# EAGLE design DimBlue (EAGLE 5.11)
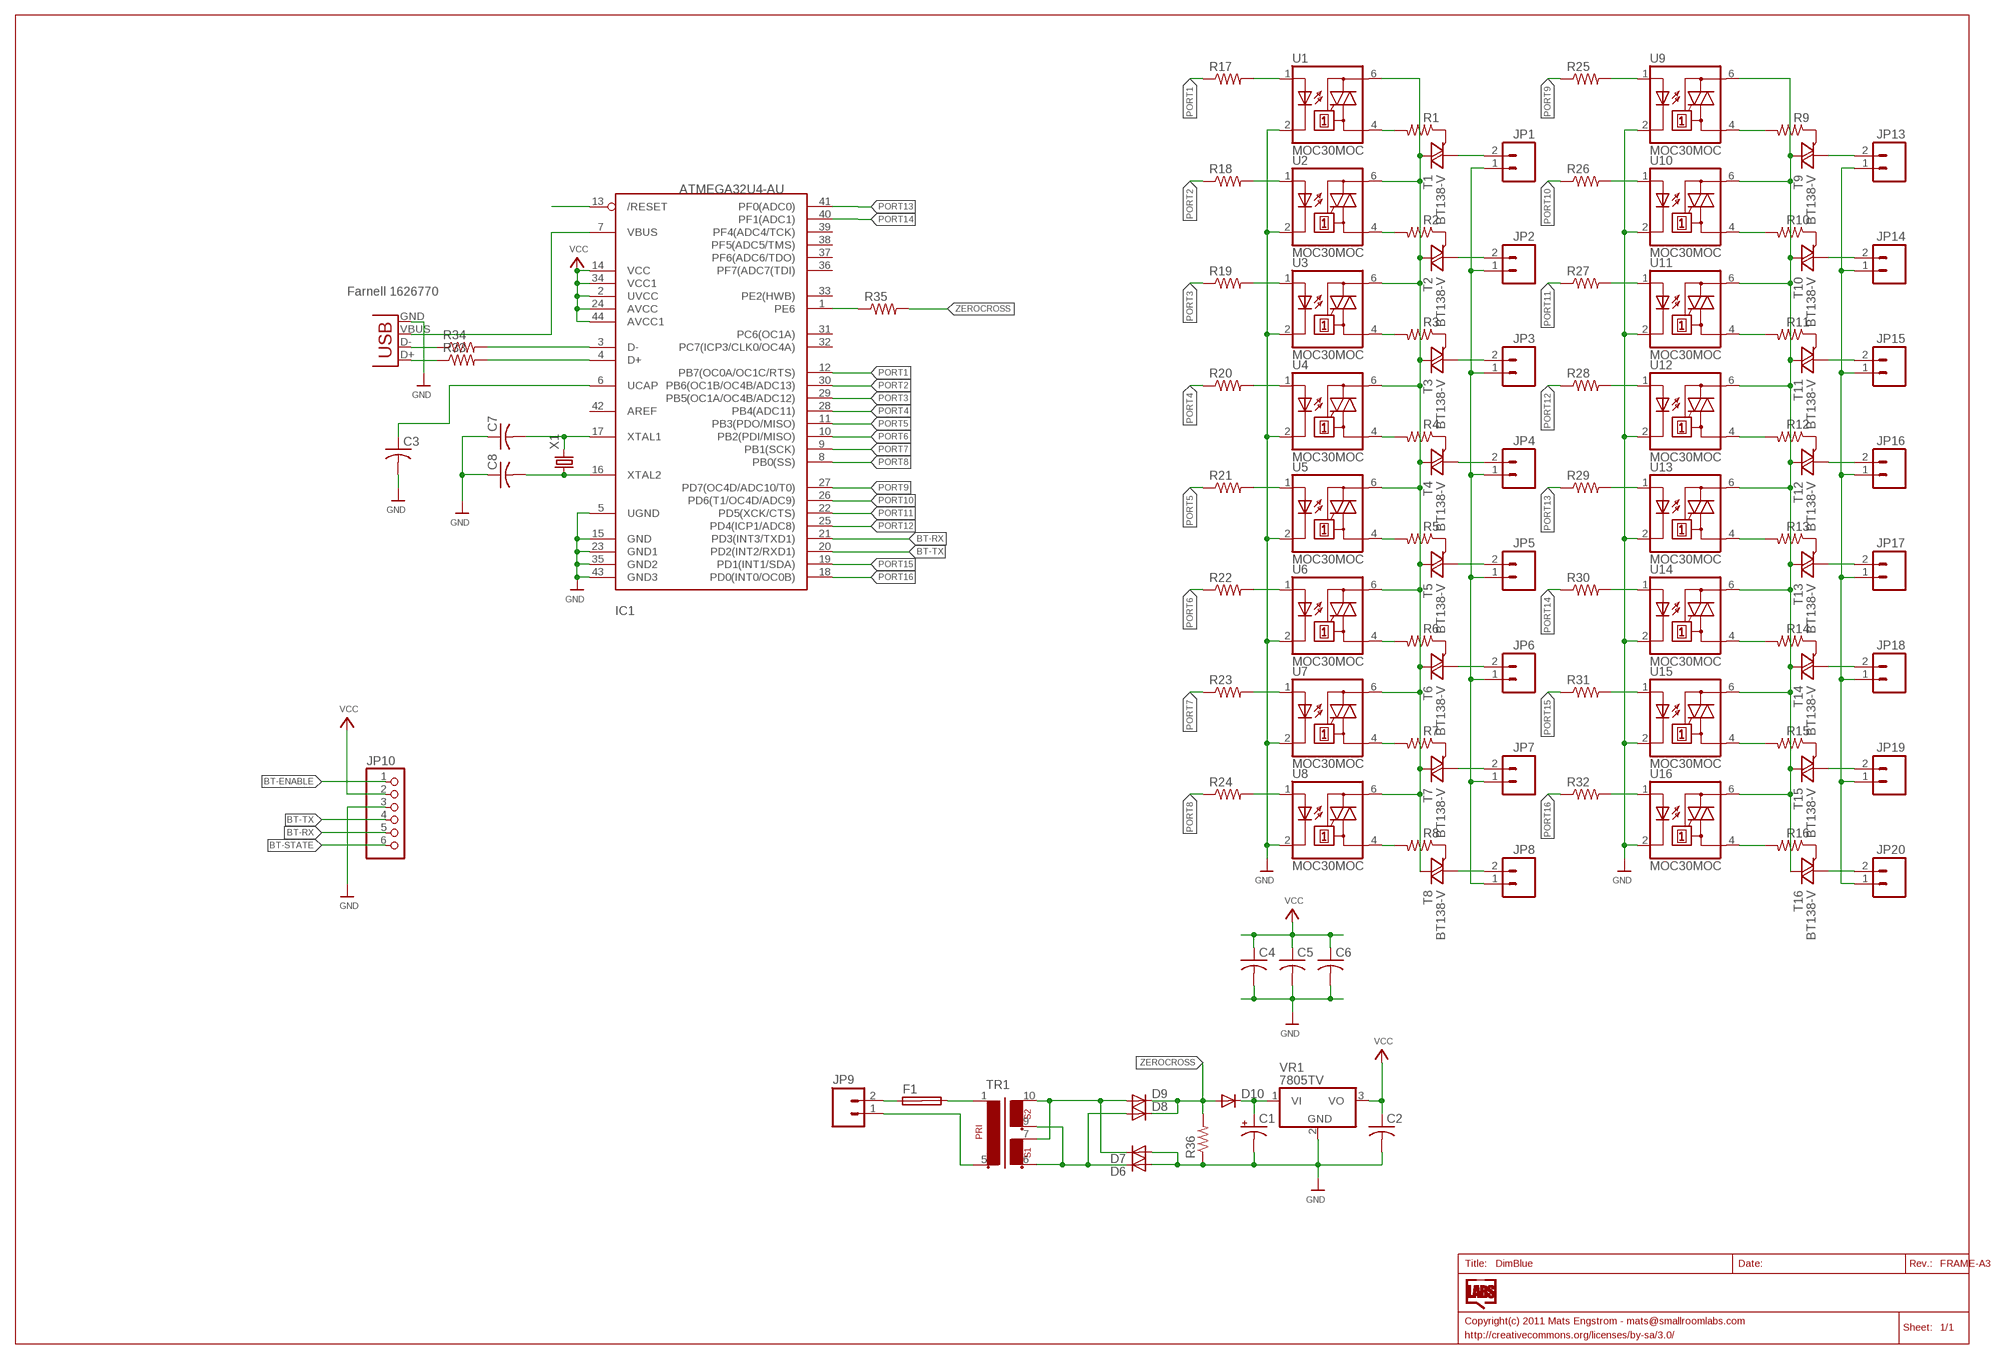
[diagram p0: schematic, sheet 1]

## Parts
C1  CAP_POLPTH4  [CPOL-RADIAL-1000UF-25V]
C2  C-US025-025X050  [C025-025X050]
C3  C-US025-025X050  [C025-025X050]
C4  C-US025-025X050  [C025-025X050]
C5  C-US025-025X050  [C025-025X050]
C6  C-US025-025X050  [C025-025X050]
C7  C-US025-024X044  [C025-024X044]
C8  C-US025-024X044  [C025-024X044]
D6  DIODE-C1702-05  [C1702-05]
D7  DIODE-C1702-05  [C1702-05]
D8  DIODE-C1702-05  [C1702-05]
D9  DIODE-C1702-05  [C1702-05]
D10  DIODE-C1702-05  [C1702-05]
F1  SHK20L  [SHK20L]
IC1  ATMEGA32U4-AU  [TQFP44]
JP1  M023.5MM  [SCREWTERMINAL-3.5MM-2]
JP2  M023.5MM  [SCREWTERMINAL-3.5MM-2]
JP3  M023.5MM  [SCREWTERMINAL-3.5MM-2]
JP4  M023.5MM  [SCREWTERMINAL-3.5MM-2]
JP5  M023.5MM  [SCREWTERMINAL-3.5MM-2]
JP6  M023.5MM  [SCREWTERMINAL-3.5MM-2]
JP7  M023.5MM  [SCREWTERMINAL-3.5MM-2]
JP8  M023.5MM  [SCREWTERMINAL-3.5MM-2]
JP9  M023.5MM  [SCREWTERMINAL-3.5MM-2]
JP10  HEADER-1X6  [1X06_OVAL]
JP13  M023.5MM  [SCREWTERMINAL-3.5MM-2]
JP14  M023.5MM  [SCREWTERMINAL-3.5MM-2]
JP15  M023.5MM  [SCREWTERMINAL-3.5MM-2]
JP16  M023.5MM  [SCREWTERMINAL-3.5MM-2]
JP17  M023.5MM  [SCREWTERMINAL-3.5MM-2]
JP18  M023.5MM  [SCREWTERMINAL-3.5MM-2]
JP19  M023.5MM  [SCREWTERMINAL-3.5MM-2]
JP20  M023.5MM  [SCREWTERMINAL-3.5MM-2]
R1  R-US_0204/7  [0204/7]
R2  R-US_0204/7  [0204/7]
R3  R-US_0204/7  [0204/7]
R4  R-US_0204/7  [0204/7]
R5  R-US_0204/7  [0204/7]
R6  R-US_0204/7  [0204/7]
R7  R-US_0204/7  [0204/7]
R8  R-US_0204/7  [0204/7]
R9  R-US_0204/7  [0204/7]
R10  R-US_0204/7  [0204/7]
R11  R-US_0204/7  [0204/7]
R12  R-US_0204/7  [0204/7]
R13  R-US_0204/7  [0204/7]
R14  R-US_0204/7  [0204/7]
R15  R-US_0204/7  [0204/7]
R16  R-US_0204/7  [0204/7]
R17  R-US_0204/2V  [0204V]
R18  R-US_0204/2V  [0204V]
R19  R-US_0204/2V  [0204V]
R20  R-US_0204/2V  [0204V]
R21  R-US_0204/2V  [0204V]
R22  R-US_0204/2V  [0204V]
R23  R-US_0204/2V  [0204V]
R24  R-US_0204/2V  [0204V]
R25  R-US_0204/2V  [0204V]
R26  R-US_0204/2V  [0204V]
R27  R-US_0204/2V  [0204V]
R28  R-US_0204/2V  [0204V]
R29  R-US_0204/2V  [0204V]
R30  R-US_0204/2V  [0204V]
R31  R-US_0204/2V  [0204V]
R32  R-US_0204/2V  [0204V]
R33  R-US_0204/2V  [0204V]
R34  R-US_0204/2V  [0204V]
R35  R-US_0204/2V  [0204V]
R36  R-US_0204/2V  [0204V]
T1  BT138-V  [TO220BV]
T2  BT138-V  [TO220BV]
T3  BT138-V  [TO220BV]
T4  BT138-V  [TO220BV]
T5  BT138-V  [TO220BV]
T6  BT138-V  [TO220BV]
T7  BT138-V  [TO220BV]
T8  BT138-V  [TO220BV]
T9  BT138-V  [TO220BV]
T10  BT138-V  [TO220BV]
T11  BT138-V  [TO220BV]
T12  BT138-V  [TO220BV]
T13  BT138-V  [TO220BV]
T14  BT138-V  [TO220BV]
T15  BT138-V  [TO220BV]
T16  BT138-V  [TO220BV]
TR1  EI30-2  [EI30-2]
U1  MOC30MOC  [DIL06-MOC]
U2  MOC30MOC  [DIL06-MOC]
U3  MOC30MOC  [DIL06-MOC]
U4  MOC30MOC  [DIL06-MOC]
U5  MOC30MOC  [DIL06-MOC]
U6  MOC30MOC  [DIL06-MOC]
U7  MOC30MOC  [DIL06-MOC]
U8  MOC30MOC  [DIL06-MOC]
U9  MOC30MOC  [DIL06-MOC]
U10  MOC30MOC  [DIL06-MOC]
U11  MOC30MOC  [DIL06-MOC]
U12  MOC30MOC  [DIL06-MOC]
U13  MOC30MOC  [DIL06-MOC]
U14  MOC30MOC  [DIL06-MOC]
U15  MOC30MOC  [DIL06-MOC]
U16  MOC30MOC  [DIL06-MOC]
USB  USBPTH  [USB-B-PTH]
VR1  7805TV  [TO220V]
X1  CRYSTALHC49US  [HC49US]

## Nets
BT-ENABLE: JP10.1
BT-RX: IC1.21(PD3(INT3/TXD1)) JP10.5
BT-STATE: JP10.6
BT-TX: IC1.20(PD2(INT2/RXD1)) JP10.4
D+: IC1.4(D+) R33.2
D+CON: R33.1 USB.D+
D-: IC1.3(D-) R34.2
D-CON: R34.1 USB.D-
GND: C1.2(-) C2.2 C3.2 C4.2 C5.2 C6.2 C7.1 C8.1 D6.A D7.A IC1.5(UGND) IC1.15(GND) IC1.23(GND1) IC1.35(GND2) IC1.43(GND3) JP10.3 R36.1 U1.2(C) U2.2(C) U3.2(C) U4.2(C) U5.2(C) U6.2(C) U7.2(C) U8.2(C) U9.2(C) U10.2(C) U11.2(C) U12.2(C) U13.2(C) U14.2(C) U15.2(C) U16.2(C) USB.GND VR1.2(GND)
LIVE [HV]: F1.2A T1.T2(A2) T2.T2(A2) T3.T2(A2) T4.T2(A2) T5.T2(A2) T6.T2(A2) T7.T2(A2) T8.T2(A2) T9.T2(A2) T10.T2(A2) T11.T2(A2) T12.T2(A2) T13.T2(A2) T14.T2(A2) T15.T2(A2) T16.T2(A2) TR1.1 U1.6(A2) U2.6(A2) U3.6(A2) U4.6(A2) U5.6(A2) U6.6(A2) U7.6(A2) U8.6(A2) U9.6(A2) U10.6(A2) U11.6(A2) U12.6(A2) U13.6(A2) U14.6(A2) U15.6(A2) U16.6(A2)
N$1 [HV]: JP1.2 T1.T1(A1)
N$2 [HV]: JP2.2 T2.T1(A1)
N$3 [HV]: JP3.2 T3.T1(A1)
N$4 [HV]: JP14.2 T10.T1(A1)
N$5 [HV]: F1.1A JP9.2
N$6 [HV]: JP4.2 T4.T1(A1)
N$7 [HV]: JP5.2 T5.T1(A1)
N$8 [HV]: JP6.2 T6.T1(A1)
N$9 [HV]: JP7.2 T7.T1(A1)
N$10 [HV]: JP8.2 T8.T1(A1)
N$11 [HV]: R1.1 T1.G
N$12 [HV]: R1.2 U1.4(A1)
N$13 [HV]: JP15.2 T11.T1(A1)
N$14 [HV]: JP16.2 T12.T1(A1)
N$15 [HV]: JP17.2 T13.T1(A1)
N$16 [HV]: JP18.2 T14.T1(A1)
N$17 [HV]: JP19.2 T15.T1(A1)
N$18 [HV]: JP20.2 T16.T1(A1)
N$19 [HV]: R2.1 T2.G
N$20 [HV]: JP13.2 T9.T1(A1)
N$21 [HV]: R2.2 U2.4(A1)
N$22 [HV]: R3.1 T3.G
N$23 [HV]: R3.2 U3.4(A1)
N$24 [HV]: R4.1 T4.G
N$25 [HV]: R4.2 U4.4(A1)
N$26 [HV]: R5.1 T5.G
N$27 [HV]: R5.2 U5.4(A1)
N$28 [HV]: R6.1 T6.G
N$29 [HV]: R6.2 U6.4(A1)
N$30 [HV]: R7.1 T7.G
N$31 [HV]: R8.1 T8.G
N$32 [HV]: R7.2 U7.4(A1)
N$33 [HV]: R8.2 U8.4(A1)
N$34 [HV]: R9.1 T9.G
N$35 [HV]: R10.1 T10.G
N$36 [HV]: R11.1 T11.G
N$37 [HV]: R12.1 T12.G
N$38 [HV]: R13.1 T13.G
N$39 [HV]: R14.1 T14.G
N$40 [HV]: R15.1 T15.G
N$41 [HV]: R16.1 T16.G
N$42 [HV]: R16.2 U16.4(A1)
N$43 [HV]: R15.2 U15.4(A1)
N$44 [HV]: R14.2 U14.4(A1)
N$45 [HV]: R13.2 U13.4(A1)
N$46 [HV]: R12.2 U12.4(A1)
N$47 [HV]: R11.2 U11.4(A1)
N$48 [HV]: R10.2 U10.4(A1)
N$49 [HV]: R9.2 U9.4(A1)
N$50: C1.1(+) D10.C VR1.1(VI)
N$51: C8.2 IC1.16(XTAL2) X1.1
N$52: D6.C D8.A TR1.6 TR1.9
N$57: IC1.7(VBUS) USB.VBUS
N$58: C7.2 IC1.17(XTAL1) X1.2
N$59: IC1.1(PE6) R35.1
N$60: C3.1 IC1.6(UCAP)
N$62: D7.C D9.A TR1.7 TR1.10
NEUTRAL [HV]: JP1.1 JP2.1 JP3.1 JP4.1 JP5.1 JP6.1 JP7.1 JP8.1 JP9.1 JP13.1 JP14.1 JP15.1 JP16.1 JP17.1 JP18.1 JP19.1 JP20.1 TR1.5
OUT1: R17.2 U1.1(A)
OUT2: R18.2 U2.1(A)
OUT3: R19.2 U3.1(A)
OUT4: R20.2 U4.1(A)
OUT5: R21.2 U5.1(A)
OUT6: R22.2 U6.1(A)
OUT7: R23.2 U7.1(A)
OUT8: R24.2 U8.1(A)
OUT9: R25.2 U9.1(A)
OUT10: R26.2 U10.1(A)
OUT11: R27.2 U11.1(A)
OUT12: R28.2 U12.1(A)
OUT13: R29.2 U13.1(A)
OUT14: R30.2 U14.1(A)
OUT15: R31.2 U15.1(A)
OUT16: R32.2 U16.1(A)
PORT1: IC1.12(PB7(OC0A/OC1C/RTS)) R17.1
PORT2: IC1.30(PB6(OC1B/OC4B/ADC13)) R18.1
PORT3: IC1.29(PB5(OC1A/OC4B/ADC12)) R19.1
PORT4: IC1.28(PB4(ADC11)) R20.1
PORT5: IC1.11(PB3(PDO/MISO)) R21.1
PORT6: IC1.10(PB2(PDI/MISO)) R22.1
PORT7: IC1.9(PB1(SCK)) R23.1
PORT8: IC1.8(PB0(SS)) R24.1
PORT9: IC1.27(PD7(OC4D/ADC10/T0)) R25.1
PORT10: IC1.26(PD6(T1/OC4D/ADC9)) R26.1
PORT11: IC1.22(PD5(XCK/CTS)) R27.1
PORT12: IC1.25(PD4(ICP1/ADC8)) R28.1
PORT13: IC1.41(PF0(ADC0)) R29.1
PORT14: IC1.40(PF1(ADC1)) R30.1
PORT15: IC1.19(PD1(INT1/SDA)) R31.1
PORT16: IC1.18(PD0(INT0/OC0B)) R32.1
RESET: IC1.13(/RESET)
VCC: C2.1 C4.1 C5.1 C6.1 IC1.2(UVCC) IC1.14(VCC) IC1.24(AVCC) IC1.34(VCC1) IC1.44(AVCC1) JP10.2 VR1.3(VO)
ZEROCROSS: D8.C D9.C D10.A R35.2 R36.2
Unconnected: F1.1B F1.2B IC1.31(PC6(OC1A)) IC1.32(PC7(ICP3/CLK0/OC4A)) IC1.33(PE2(HWB)) IC1.36(PF7(ADC7(TDI)) IC1.37(PF6(ADC6/TDO)) IC1.38(PF5(ADC5/TMS)) IC1.39(PF4(ADC4/TCK)) IC1.42(AREF)

## Notes on the sheet
- Farnell 1626770

## Library data of the parts
C1 = SparkFun:CAP_POL: Capacitor Polarized These are standard SMD and PTH capacitors. Normally 10uF, 47uF, and 100uF in electrolytic and tantalum varieties. Always verify the external diameter of the through hole cap, it varies with capacity, voltage, and manufacturer. The EIA devices should be standard.
C2-C8 = adafruit:C-US: CAPACITOR, American symbol
D6-D10 = diode:DIODE-: DIODE
F1 = fuse:SHK20L: FUSE HOLDER 5 x 20 mm, SH contact, SHH1 Schukat, E1073 Buerklin; OC_FARNELL: unknown; OC_NEWARK: unknown
IC1 = adafruit:ATMEGA32U4: http://www.ladyada.net/library/eagle
JP1-JP9 JP13-JP20 = SparkFun:M02: Header 2 Standard 2-pin 0.1" header. Use with straight break away headers (SKU : PRT-00116), right angle break away headers (PRT-00553), swiss pins (PRT-00743), machine pins (PRT-00117), and female headers (PRT-00115). Molex polarized connector foot print use with SKU : PRT-08233 with associated crimp pins and housings.
JP10 = microbuilder:HEADER-1X6: PIN HEADER
R1-R36 = adafruit:R-US_: RESISTOR, American symbol
T1-T16 = triac:BT138: TRIAC Source: http://www.semiconductors.philips.com BT138_SERIES_2.pdf
TR1 = trafo:EI30-2: TRANSFORMER 1 primary winding, 2 secondary windings ERA
U1-U16 = SmallRoomLabs:MOC30*
USB = SparkFun:USB: USB Connectors USB-B-PTH is fully proven SKU : PRT-00139 USB-miniB is fully proven SKU : PRT-00587 USB-A-PCB is untested. USB-A-H is throughly reviewed, but untested. Spark Fun Electronics SKU : PRT-00437 USB-B-SMT is throughly reviewed, but untested. Needs silkscreen touching up. USB-A-S has not been used/tested USB-MB-H has not been used/tested
VR1 = linear:78*: Positive VOLTAGE REGULATOR Source: http://cache.national.com/ds/LM/LM78L05.pdf http://www.fairchildsemi.com/ds/LM/LM7805.pdf
X1 = SparkFun:CRYSTAL: Crystals Various standard crystals. Proven footprints. Spark Fun Electronics SKU : COM-00534

## Net classes
0 default: width 0.203 mm, clearance 0.203 mm
1 HV: clearance 1 mm

## Board
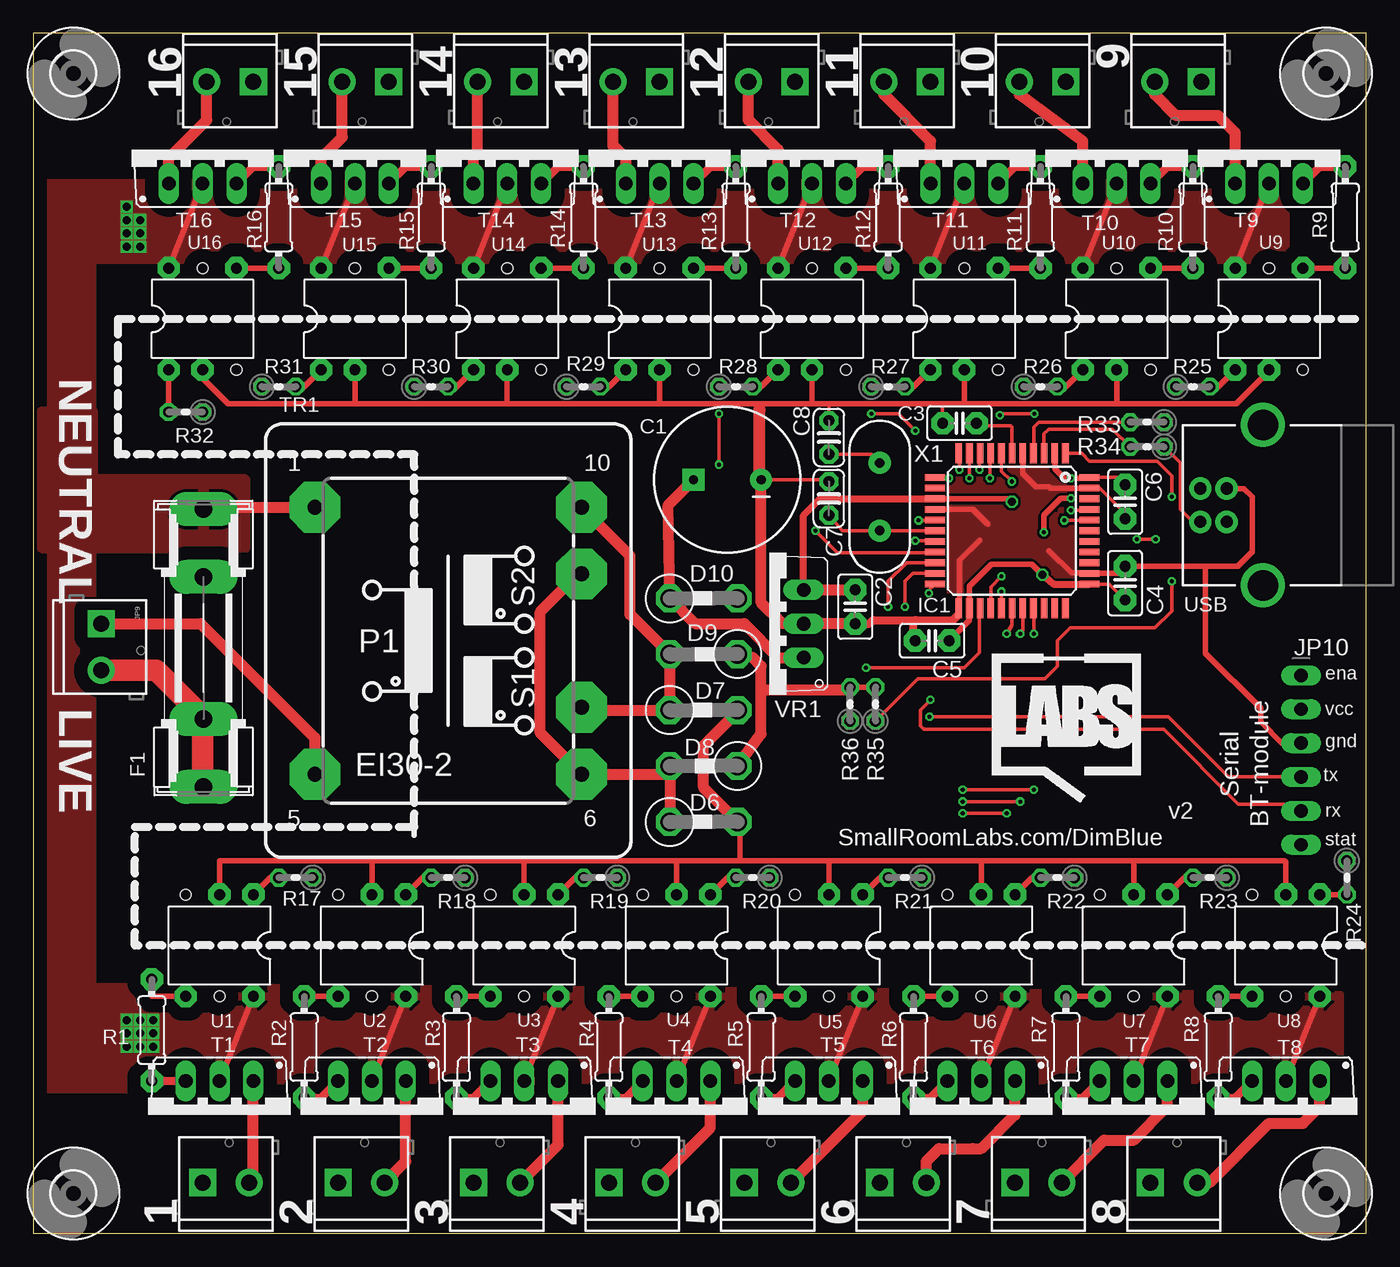
[diagram p1: board, top side]
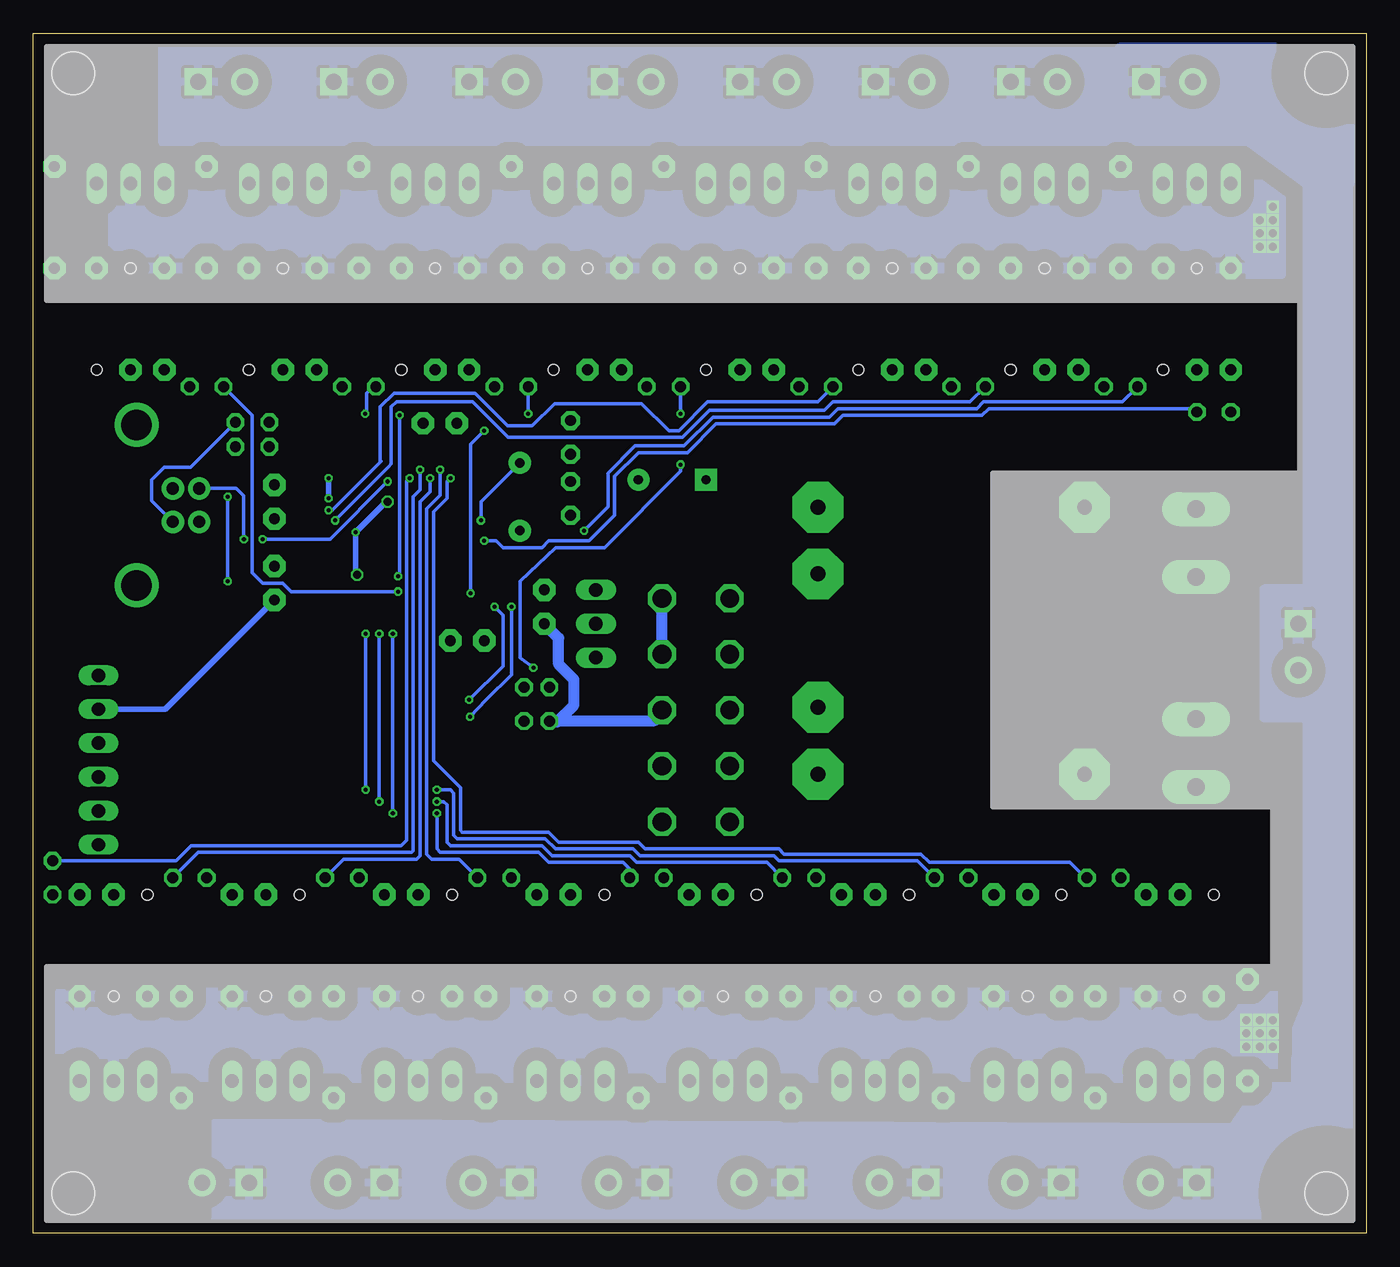
[diagram p2: board, bottom side, seen from below]

Size 100 x 90 mm. Coordinates in mm from the lower left corner, seen from the top.
Outline: 0,0 100,0 100,90 0,90 0,0
Copper layers (1*16): Top 0.035mm / dielectric 1.5mm / Bottom 0.035mm
Design rules "Fusion_eagle_rule_v1.1": minimum track width 6mil, minimum drill 12mil, track to track 6mil, track to pad 6mil, pad to pad 6mil, via to via 6mil, smd to smd 0mil, copper to edge 10mil, drill to drill 10mil, minimum pad ring 10mil, minimum via ring 6mil, stop-mask expansion 2mil, vias tented up to drill 100mil, thermal gap 10mil

### Footprints (pad centres in the part's own frame; a part is rotated, then mirrored left to right if it is on the bottom)
CPOL-RADIAL-1000UF-25V = drill 0.7 pad 1.651 square: 1 2.54,0 | drill 0.7 pad 1.651 round: 2 -2.54,0
C025-025X050 = drill 0.813 pad 1.676 octagon: 1 -1.27,0; 2 1.27,0
C025-024X044 = drill 0.813 pad 1.422 octagon: 1 -1.27,0; 2 1.27,0
C1702-05 = drill 1.397 octagon: A 2.54,0; C -2.54,0
SHK20L = drill 1.321 pad 2.54 long: 1A -10.414,0; 1B -5.334,0; 2A 10.414,0; 2B 5.334,0
TQFP44 = smd 1.5 x 0.5: 1 -5.8,4; 2 -5.8,3.2; 3 -5.8,2.4; 4 -5.8,1.6; 5 -5.8,0.8; 6 -5.8,0; 7 -5.8,-0.8; 8 -5.8,-1.6; 9 -5.8,-2.4; 10 -5.8,-3.2; 11 -5.8,-4; 23 5.8,-4; 24 5.8,-3.2; 25 5.8,-2.4; 26 5.8,-1.6; 27 5.8,-0.8; 28 5.8,0; 29 5.8,0.8; 30 5.8,1.6; 31 5.8,2.4; 32 5.8,3.2; 33 5.8,4 | smd 0.5 x 1.5: 12 -4,-5.8; 13 -3.2,-5.8; 14 -2.4,-5.8; 15 -1.6,-5.8; 16 -0.8,-5.8; 17 0,-5.8; 18 0.8,-5.8; 19 1.6,-5.8; 20 2.4,-5.8; 21 3.2,-5.8; 22 4,-5.8; 34 4,5.8; 35 3.2,5.8; 36 2.4,5.8; 37 1.6,5.8; 38 0.8,5.8; 39 0,5.8; 40 -0.8,5.8; 41 -1.6,5.8; 42 -2.4,5.8; 43 -3.2,5.8; 44 -4,5.8
SCREWTERMINAL-3.5MM-2 = drill 1.2 pad 2.032 square: 1 0,0 | drill 1.2 pad 2.032 round: 2 3.5,0
1X06_OVAL = drill 1 long: 1 -6.35,0; 2 -3.81,0; 3 -1.27,0; 4 1.27,0; 5 3.81,0; 6 6.35,0
0204/7 = drill 0.813 pad 1.676 octagon: 1 -3.81,0; 2 3.81,0
0204V = drill 0.813 octagon: 1 -1.27,0; 2 1.27,0
TO220BV = drill 1.016 long: G 2.54,-2.54; T1 -2.54,-2.54; T2 0,-2.54
EI30-2 = drill 1.118 pad 3.81 octagon: 1 -10.008,10.008; 5 -10.008,-10.008; 6 10.008,-10.008; 7 10.008,-5.004; 9 10.008,5.004; 10 10.008,10.008
DIL06-MOC = drill 0.813 pad 1.676 octagon: 1 -2.54,-3.81; 2 0,-3.81; 4 2.54,3.81; 6 -2.54,3.81 | hole 0.813: 0,3.81; 2.54,-3.81
3,2 = hole 3.2: 0,0
USB-B-PTH = drill 0.914 pad 1.676 round: D+ 0,1.25; D- 1.981,1.25; GND 0,-1.25; VBUS 1.981,-1.25 | drill 2.286 round: S1 -2.718,-6.02; S2 -2.718,6.02
TO220V = drill 1.016 long: 1 -2.54,-2.54; 2 0,-2.54; 3 2.54,-2.54
HC49US = drill 0.7 pad 1.651 round: 1 -2.54,0; 2 2.54,0

### Placement (x,y rotation side)
C1  52.07,56.52 180 top
C2  61.66,46.99 270 top
C3  69.49,60.76 180 top
C4  81.92,48.77 90 top
C5  67.44,44.45 180 top
C6  81.92,54.86 270 top
C7  59.69,55.12 270 top
C8  59.69,59.69 270 top
D6  50.29,30.86 0 top
D7  50.29,39.24 0 top
D8  50.29,35.05 180 top
D9  50.29,43.43 180 top
D10  50.29,47.62 0 top
F1  12.77,43.9 90 top
IC1  73.43,52.7 270 top
JP1  12.7,3.81 0 top
JP2  22.86,3.81 0 top
JP3  33.02,3.81 0 top
JP4  43.18,3.81 0 top
JP5  53.34,3.81 0 top
JP6  63.5,3.81 0 top
JP7  73.66,3.81 0 top
JP8  83.82,3.81 0 top
JP9  5.08,45.72 270 top
JP10  95.12,35.5 270 top
JP13  87.63,86.36 180 top
JP14  77.47,86.36 180 top
JP15  67.31,86.36 180 top
JP16  57.15,86.36 180 top
JP17  46.99,86.36 180 top
JP18  36.83,86.36 180 top
JP19  26.67,86.36 180 top
JP20  16.51,86.36 180 top
R1  8.89,15.24 90 top
R2  20.32,13.97 90 top
R3  31.75,13.97 90 top
R4  43.18,13.97 90 top
R5  54.61,13.97 90 top
R6  66.04,13.97 90 top
R7  77.47,13.97 90 top
R8  88.9,13.97 90 top
R9  98.42,76.2 270 top
R10  87,76.2 270 top
R11  75.56,76.2 270 top
R12  64.14,76.2 270 top
R13  52.7,76.2 270 top
R14  41.27,76.2 270 top
R15  29.84,76.2 270 top
R16  18.41,76.2 270 top
R17  19.68,26.67 180 top
R18  31.11,26.67 180 top
R19  42.55,26.67 180 top
R20  53.98,26.67 180 top
R21  65.41,26.67 180 top
R22  76.83,26.67 180 top
R23  88.27,26.67 180 top
R24  98.55,26.67 270 top
R25  87,63.5 0 top
R26  75.56,63.5 0 top
R27  64.14,63.5 0 top
R28  52.7,63.5 0 top
R29  41.27,63.5 0 top
R30  29.84,63.5 0 top
R31  18.41,63.5 0 top
R32  11.43,61.59 180 top
R33  83.57,60.83 180 top
R34  83.57,58.99 180 top
R35  63.18,39.69 90 top
R36  61.28,39.69 90 top
T1  13.97,8.89 180 top
T2  25.4,8.89 180 top
T3  36.83,8.89 180 top
T4  48.26,8.89 180 top
T5  59.69,8.89 180 top
T6  71.12,8.89 180 top
T7  82.55,8.89 180 top
T8  93.98,8.89 180 top
T9  92.71,81.28 0 top
T10  81.28,81.28 0 top
T11  69.85,81.28 0 top
T12  58.42,81.28 0 top
T13  46.99,81.28 0 top
T14  35.56,81.28 0 top
T15  24.13,81.28 0 top
T16  12.7,81.28 0 top
TR1  31.13,44.45 0 top
U1  13.97,21.59 180 top
U2  25.4,21.59 180 top
U3  36.83,21.59 180 top
U4  48.26,21.59 180 top
U5  59.69,21.59 180 top
U6  71.12,21.59 180 top
U7  82.55,21.59 180 top
U8  93.98,21.59 180 top
U9  92.71,68.58 0 top
U10  81.28,68.58 0 top
U11  69.85,68.58 0 top
U12  58.42,68.58 0 top
U13  46.99,68.58 0 top
U14  35.56,68.58 0 top
U15  24.13,68.58 0 top
U16  12.7,68.58 0 top
U$2  [SRL-LOGO-SILK-10MM]  71.93,32.31 0 top
U$4  [3,2]  3,3 0 top
U$5  [3,2]  97,3 0 top
U$6  [3,2]  3,87 0 top
U$7  [3,2]  97,87 0 top
USB  89.53,54.61 180 top
VR1  55.24,45.72 90 top
X1  63.5,55.24 270 top

### Tracks (layer width: path | path; a pad name or v marks a point on that pad's centre or on a via)
BT-RX  (via drill 0.3)
  Top 0.254: IC1.21 66.01,49.5 65.41,48.9 v65.41,46.99 | JP10.5 94.31,31.69 93.8,32.2 90.4,32.2 84.8,37.8 66.8,37.8 66.55,38.05 66.55,39.22 67.31,39.98 v67.31,40.01
  Bottom 0.254: v65.41,46.99 64.77,46.35 64.77,42.55 v67.31,40.01
BT-TX  (via drill 0.3)
  Top 0.254: IC1.20 65.54,50.3 64.14,48.9 v64.14,46.99 | v67.24,38.73 85.15,38.73 89.66,34.23 JP10.4
  Bottom 0.254: v64.14,46.99 64.14,41.91 66.04,40.01 v67.24,38.73
D+
  Top 0.254: R33.2 75.44,60.83 75.06,60.45 75.06,58.52 IC1.4
D+CON
  Bottom 0.254: R33.1 88.2,57.47 90.17,57.47 91.12,56.52 91.12,54.93 89.56,53.36 USB.D+
D-
  Top 0.254: R34.2 80.96,60.33 76.2,60.33 75.83,59.96 IC1.3
D-CON
  Top 0.254: R34.1 86.04,57.78 86.04,54.29 86.97,53.36 USB.D-
GND
  Top 0.254: 59.82,62.23 59.69,62.1 C8.1 | C1.2 59.44,56.52 C7.1 | C6.2 81.92,53.98 80.01,55.88 79.25,55.88 IC1.43 | 90.27,62.23 90.32,62.18 | C3.2 68.22,62.08 68.07,62.23 | U16.2 12.7,64.14
  Top 0.406: 25.4,27.94 13.97,27.94 U1.2 | 25.4,27.94 36.83,27.94 | 36.83,27.94 48.26,27.94 | 48.26,27.94 53.02,27.94 | 53.02,27.94 59.69,27.94 | 59.69,27.94 71.12,27.94 | 71.12,27.94 82.55,27.94 | 82.55,27.94 93.85,27.94 93.98,27.81 U8.2 | 69.85,62.23 68.07,62.23 59.82,62.23 58.42,62.23 | 69.85,62.23 81.28,62.23 | 81.28,62.23 90.27,62.23 92.71,64.67 U9.2 | 54.66,62.23 58.42,62.23 | 54.66,62.23 46.99,62.23 | 46.99,62.23 35.56,62.23 | 35.56,62.23 24.13,62.23 | 24.13,62.23 14.61,62.23 12.7,64.14 | 52.83,39.12 D7.A | D6.A 52.9,30.8 53.02,30.8 53.02,27.94 | C1.2 54.48,56.64 | 67.69,54.36 IC1.15 70.5,54.3 71.6,53.2 | IC1.43 79.21,55.88 76.32,55.88 76.2,56 75.2,56 74.23,56.97 IC1.5 | 87.95,50.04 C4.2 81.38,49.5 IC1.35 79.2,49.53 77.87,49.53 76.2,51.2 | 87.95,50.04 87.95,43.5 92.08,39.37 92.08,38.35 93.66,36.77 JP10.3 | USB.GND 90.83,55.86 91.44,55.24 91.44,51.12 90.36,50.04 87.95,50.04 | 54.46,61.77 54.46,62.03 54.66,62.23 | 25.4,27.94 U2.2 | 36.83,27.94 U3.2 | 48.26,27.94 U4.2 | 59.69,27.94 U5.2 | 71.12,27.94 U6.2 | 82.55,27.94 U7.2 | 81.28,62.23 U10.2 | 69.85,62.23 U11.2 | 58.42,62.23 U12.2 | 46.99,62.23 U13.2 | 35.56,62.23 U14.2 | 24.13,62.23 U15.2 | 71,52 69.47,50.47 69.47,46.94 IC1.23 69.4,46.87 69.4,46.4
  Top 0.61: C2.2 62.72,45.72 63,46 66.2,46 | 66.2,46 69,46 69.4,46.4 | C5.2 66.05,44.45 66,44.4 66,45.8 66.2,46
  Top 0.813: C1.2 54.61,47.31 56.2,45.72 VR1.2 C2.2 | D6.A 50.29,33.4 50.29,36.58 52.83,39.12
  Top 0.914: 54.48,56.64 54.48,61.75 54.46,61.77
  Bottom 0.813: C2.2 60.58,44.64 60.58,42.67 59.44,41.53 59.44,39.62 60.71,38.35 R36.1 53.66,38.42 arc-90 D7.A
  pour Top: 68.4,57.6 68.4,48.2 78.4,48.2 78.4,57.6
LIVE  (via drill 0.6)
  Top 0.406: T1.T2 U1.6 | T2.T2 U2.6 | T3.T2 U3.6 | T4.T2 U4.6 | T5.T2 U5.6 | T6.T2 U6.6 | T7.T2 U7.6 | T8.T2 U8.6 | U11.6 T11.T2 | U9.6 T9.T2 | U10.6 T10.T2 | U12.6 T12.T2 | U13.6 T13.T2 | U14.6 T14.T2 | U15.6 T15.T2 | U16.6 T16.T2
  Top 0.813: TR1.1 12.91,54.46 F1.2A
  other vias: 7,14 7,16 9,15 7,15 8,15 8,16 9,16 8,14 9,14 7,74 7,75 7,76 7,77 8,74 8,75 8,76
  pour Top (isolate 1, no thermals): 93.98,78.74 0.64,78.74 0.64,61.59 4.45,61.59 4.45,73.03 93.98,73.03
  pour Top: 15.88,51.44 15.88,56.52 4.45,56.52 4.45,61.59 0.64,61.59 0.64,51.44
  pour Top (isolate 1): 0.64,51.44 0.64,10.79 98.06,10.79 98.06,17.88 4.45,18.51 4.45,52.07
  pour Bottom (isolate 1): 98,18 98,11 7,11 7,18
  pour Bottom (isolate 1, rank 2): 6.4,78.6 94,78.6 94,72 6.4,72
N$1
  Top 0.813: JP1.2 16.51,4.12 T1.T1
N$2
  Top 0.813: JP2.2 27.94,5.39 T2.T1
N$3
  Top 0.813: JP3.2 39.37,6.66 T3.T1
N$4
  Top 0.813: T10.T1 78.74,81.92 73.97,85.42 JP14.2
N$5
  Top 0.813: 12.7,33.55 F1.1A
  Top 1.626: JP9.2 9.21,42.22 12.7,38.73 12.7,33.55
N$6
  Top 0.813: JP4.2 50.8,7.93 T4.T1
N$7
  Top 0.813: JP5.2 62.23,9.2 T5.T1
N$8
  Top 0.813: JP6.2 67,5.41 67.94,6.35 70.48,6.35 71.12,6.35 73.66,8.89 T6.T1
N$9
  Top 0.813: JP7.2 80.33,6.99 82.55,6.99 85.09,9.53 T7.T1
N$10
  Top 0.813: T8.T1 96.52,9.53 95.25,8.26 92.71,8.26 88.27,3.81 JP8.2
N$11
  Top 0.61: R1.1 10.16,11.43 T1.G
N$12
  Top 0.406: U1.4 8.89,17.78 R1.2
N$13
  Top 0.813: T11.T1 67.31,81.92 63.81,85.42 JP15.2
N$14
  Top 0.813: T12.T1 55.88,81.28 53.65,83.51 JP16.2
N$15
  Top 0.813: T13.T1 44.45,80.64 43.49,81.61 JP17.2
N$16
  Top 0.61: 33.02,80.64 33.33,80.95
  Top 0.813: T14.T1 33.02,80.64 | 33.33,80.95 JP18.2
N$17
  Top 0.813: T15.T1 21.59,80.64 23.17,82.22 JP19.2
N$18
  Top 0.813: T16.T1 10.16,80.64 13.01,83.5 JP20.2
N$19
  Top 0.61: R2.1 21.59,10.16 T2.G
N$20
  Top 0.813: T9.T1 90.17,82.55 88.9,83.82 85.72,83.82 84.13,85.42 JP13.2
N$21
  Top 0.406: R2.2 U2.4
N$22
  Top 0.61: R3.1 33.02,10.16 T3.G
N$23
  Top 0.406: R3.2 U3.4
N$24
  Top 0.61: R4.1 44.45,10.16 T4.G
N$25
  Top 0.406: R4.2 U4.4
N$26
  Top 0.61: R5.1 55.88,10.16 T5.G
N$27
  Top 0.406: R5.2 U5.4
N$28
  Top 0.61: R6.1 67.31,10.16 T6.G
N$29
  Top 0.406: R6.2 U6.4
N$30
  Top 0.61: R7.1 78.74,10.16 T7.G
N$31
  Top 0.61: R8.1 90.17,10.16 T8.G
N$32
  Top 0.406: R7.2 U7.4
N$33
  Top 0.406: R8.2 U8.4
N$34
  Top 0.61: R9.1 96.52,80.01 T9.G
N$35
  Top 0.61: R10.1 85.09,80.01 T10.G
N$36
  Top 0.61: R11.1 73.66,80.01 T11.G
N$37
  Top 0.61: R12.1 62.23,80.01 T12.G
N$38
  Top 0.61: R13.1 50.8,80.01 T13.G
N$39
  Top 0.61: R14.1 39.37,80.01 T14.G
N$40
  Top 0.61: R15.1 27.94,80.01 T15.G
N$41
  Top 0.61: R16.1 16.51,80.01 T16.G
N$42
  Top 0.406: U16.4 R16.2
N$43
  Top 0.406: U15.4 R15.2
N$44
  Top 0.406: U14.4 R14.2
N$45
  Top 0.406: U13.4 R13.2
N$46
  Top 0.406: U12.4 R12.2
N$47
  Top 0.406: U11.4 R11.2
N$48
  Top 0.406: U10.4 R10.2
N$49
  Top 0.406: U9.4 R9.2
N$50
  Top 0.813: C1.1 47.62,54.61 D10.C 49.66,45.72 53.34,45.72 55.88,43.18 VR1.1
N$51  (via drill 0.3)
  Top 0.254: IC1.16 66.45,53.5 v66.42,53.47 | C8.2 62.87,58.42 X1.1
  Bottom 0.254: v66.42,53.47 66.42,54.86 X1.1
N$52
  Top 0.406: 40.88,49.45 TR1.9
  Top 0.813: 40.88,49.45 38.04,46.61 38.04,37.54 TR1.6 47.75,34.44 D8.A D6.C
N$57  (via drill 0.3)
  Top 0.254: v73.41,56.39 72.63,57.16 IC1.7 | v82.8,52.07 v84.2,52.07
  Bottom 0.254: v73.41,56.39 77.72,52.07 v82.8,52.07 | v84.2,52.07 84.2,55.31 84.77,55.88 87.53,55.88 USB.VBUS
N$58
  Top 0.254: IC1.17 X1.2 60.71,52.7 C7.2
N$59  (via drill 0.3)
  Top 0.254: R35.1 66.36,41.59 75.88,41.59 76.83,42.55 76.83,44.45 77.79,45.4 84.14,45.4 85.41,46.67 v85.41,48.9 | v85.41,55.24 85.41,56.83 84.33,57.91 79.25,57.91 78.66,58.5 IC1.1
  Bottom 0.254: v85.41,48.9 v85.41,55.24
N$60
  Top 0.254: IC1.6 73.43,60.48 73.36,60.55 70.97,60.55 C3.1
N$62
  Top 0.406: TR1.7 41.34,39.24
  Top 0.813: TR1.10 44.77,50.83 44.77,46.42 D9.A D7.C 41.34,39.24
NEUTRAL
  Top 0.813: JP9.1 12.57,45.72 21.12,37.17 TR1.5
  pour Bottom (isolate 1, rank 2): 90.33,90.17 0,90.17 0,0 86.33,0 86.33,8.35 10,8 5.79,14 4.45,17.35 4.45,81.82 90.33,81.82
  pour Bottom (isolate 1): 2.54,48.26 7.62,48.26 7.62,38.73 2.54,38.73
  pour Bottom: 1.27,78.74 4.45,78.74 11.43,83.82 18.41,83.82 18.41,88.9 1.27,88.9 1.27,79.38
OUT1
  Top 0.406: R17.2 17.78,26.67 U1.1
OUT2
  Top 0.406: R18.2 29.21,26.67 U2.1
OUT3
  Top 0.406: R19.2 40.64,26.67 U3.1
OUT4
  Top 0.406: R20.2 52.07,26.67 U4.1
OUT5
  Top 0.406: R21.2 63.5,26.67 U5.1
OUT6
  Top 0.406: R22.2 74.93,26.67 U6.1
OUT7
  Top 0.406: R23.2 86.36,26.67 U7.1
OUT8
  Top 0.406: U8.1 R24.2
OUT9
  Top 0.406: R25.2 88.9,63.5 U9.1
OUT10
  Top 0.406: R26.2 77.47,63.5 U10.1
OUT11
  Top 0.406: R27.2 66.04,63.5 U11.1
OUT12
  Top 0.406: R28.2 54.61,63.5 U12.1
OUT13
  Top 0.406: R29.2 43.18,63.5 U13.1
OUT14
  Top 0.406: R30.2 31.75,63.5 U14.1
OUT15
  Top 0.406: R31.2 20.32,63.5 U15.1
OUT16
  Top 0.406: R32.2 U16.1
PORT1  (via drill 0.3)
  Top 0.254: IC1.12 68.65,56.7 v68.71,56.64
  Bottom 0.254: R17.1 21.08,26.67 22.23,27.81 32.77,27.81 33.4,28.45 43.69,28.45 44.07,28.83 54.1,28.83 54.61,29.34 60.58,29.34 61.34,30.1 67.82,30.1 67.94,30.23 67.94,33.4 69.98,35.43 69.98,54.1 68.96,55.12 68.96,56.39 v68.71,56.64
PORT2  (via drill 0.3)
  Top 0.254: IC1.30 75.06,46.87 v75.06,44.96 | v69.72,33.27 v75.06,33.27
  Bottom 0.254: R18.1 33.66,27.94 44.07,27.94 44.45,28.32 54.48,28.32 54.99,28.83 60.83,28.83 61.59,29.59 68.2,29.59 68.45,29.84 68.45,33.02 68.71,33.27 v69.72,33.27 | v75.06,33.27 v75.06,44.96
PORT3  (via drill 0.3)
  Top 0.254: IC1.29 74.23,45.28 v74.04,44.96 | v69.72,32.38 v74.04,32.38
  Bottom 0.254: R19.1 44.96,27.81 54.74,27.81 55.24,28.32 61.09,28.32 61.85,29.08 68.71,29.08 68.96,29.34 68.96,32.13 69.22,32.38 v69.72,32.38 | v74.04,32.38 v74.04,44.96
PORT4  (via drill 0.3)
  Top 0.254: IC1.28 73.43,45.62 v73.03,44.96 | v69.72,31.5 v73.03,31.5
  Bottom 0.254: R20.1 55.24,27.3 55.75,27.81 61.34,27.81 62.1,28.57 69.47,28.57 69.72,28.83 v69.72,31.5 | v73.03,31.5 v73.03,44.96
PORT5  (via drill 0.3)
  Top 0.254: IC1.11 69.47,58.46 v69.47,57.28
  Bottom 0.254: R21.1 68.07,28.07 70.1,28.07 70.48,28.45 70.48,54.36 69.47,55.37 v69.47,57.28
PORT6  (via drill 0.3)
  Top 0.254: IC1.10 v70.23,56.64
  Bottom 0.254: R22.1 76.71,28.07 71.25,28.07 70.99,28.32 70.99,54.86 70.23,55.63 v70.23,56.64
PORT7  (via drill 0.3)
  Top 0.254: IC1.9 70.99,58.46 v70.99,57.28
  Bottom 0.254: R23.1 87.63,28.57 71.63,28.57 71.5,28.7 71.5,55.24 70.99,55.75 v70.99,57.28
PORT8  (via drill 0.3)
  Top 0.254: IC1.8 71.75,58.42 v71.75,56.64
  Bottom 0.254: v71.75,56.64 72.01,56.39 72.01,29.46 72.39,29.08 88.14,29.08 89.28,27.94 R24.1
PORT9  (via drill 0.3)
  Top 0.254: IC1.27 v72.63,48.12 v72.64,48.13
  Bottom 0.254: R25.1 83.57,61.34 83.57,49.53 82.8,48.77 81.28,48.77 80.64,48.13 v72.64,48.13
PORT10  (via drill 0.3)
  Top 0.254: v72.64,49.28 71.83,48.46 IC1.26 | v75.11,61.47 72.62,61.47 v72.52,61.37
  Bottom 0.254: v72.64,49.28 72.52,49.4 v72.52,61.37 | R26.1 74.47,63.5 74.98,62.99 74.98,61.59 v75.11,61.47
PORT11  (via drill 0.3)
  Top 0.254: IC1.22 67.18,48.25 v67.18,48.01 | v62.87,61.47 64.9,61.47 v66.17,60.2
  Bottom 0.254: v62.87,61.47 R27.1 | v67.18,48.01 67.18,59.18 v66.17,60.2
PORT12  (via drill 0.3)
  Top 0.254: v51.44,57.66 v51.44,61.47 | IC1.25 70.99,46.86 70.99,43.56 69.85,42.42 v62.48,42.42
  Bottom 0.254: v51.44,61.47 R28.1 | v51.44,57.66 51.44,57.15 57.15,51.44 60.83,51.44 63.5,48.9 63.5,43.18 v62.48,42.42
PORT13  (via drill 0.3)
  Top 0.254: IC1.41 79.16,54.23 v77.85,54.23
  Bottom 0.254: R29.1 41.15,62.36 49.4,62.36 51.56,60.2 52.32,60.2 54.36,62.23 60.91,62.23 62.59,60.55 64.41,60.55 66.85,62.99 72.95,62.99 73.97,61.98 73.97,57.91 73.94,57.89 | v77.85,54.23 77.6,54.23 73.94,57.89 | 73.94,57.89 73.91,57.91
PORT14  (via drill 0.3)
  Top 0.254: IC1.40 79.2,53.47 v77.34,53.47
  Bottom 0.254: R30.1 29.72,62.36 40.01,62.36 40.64,61.72 49.28,61.72 51.31,59.69 64.36,59.69 67.06,62.38 72.75,62.38 73.15,61.98 73.15,57.71 73.36,57.51 73.41,57.4 v77.34,53.47
PORT15  (via drill 0.3)
  Top 0.254: IC1.19 67.55,51.18 67.42,51.05 60.33,51.05 v58.67,52.7
  Bottom 0.254: R31.1 18.29,62.36 28.7,62.36 29.21,61.85 39.62,61.85 40.26,61.21 49.02,61.21 51.18,59.05 54.86,59.05 56.9,57.02 56.9,54.48 v58.67,52.7
PORT16  (via drill 0.3)
  Top 0.254: IC1.18 67.59,51.94 v66.17,51.94
  Bottom 0.254: R32.1 12.95,61.85 28.32,61.85 28.83,61.34 39.24,61.34 39.88,60.71 48.77,60.71 50.93,58.55 54.61,58.55 56.39,56.77 56.39,53.85 58.29,51.94 61.34,51.94 61.85,51.44 64.77,51.44 65.28,51.94 v66.17,51.94
VCC  (via drill 0.3, 0.6)
  Top 0.254: IC1.24 | IC1.34 80.72,48.7 C4.1 | IC1.44 81.35,56.7 C6.1
  Top 0.406: IC1.24 70.23,48.51 71.88,50.16 74.93,50.16 v75.69,49.4 | IC1.2 76.63,57.35 77.34,56.64 v77.85,56.64 79.17,56.64 IC1.44 | v75.82,52.58 75.82,53.85 77.09,55.12 v77.85,55.12 | IC1.14 73.17,55.1 v73.41,54.86 | IC1.24 70.23,45.98 C5.1
  Top 0.508: IC1.14 59.03,55.1 57.78,53.85 VR1.3 | v75.69,49.4 76.52,48.7 IC1.34
  Top 0.813: VR1.3 C2.1
  Bottom 0.406: v77.85,55.12 v77.85,56.64 | v75.69,49.4 75.82,49.53 v75.82,52.58 73.53,54.86 v73.41,54.86 | C4.1 90.11,39.31 JP10.2
ZEROCROSS
  Top 0.406: R36.2 R35.2
  Top 0.813: D9.C 53.98,43.18 54.61,42.55 54.61,40.77 | D8.C 54.61,37.47 54.61,40.77 | R36.2 61.09,40.77 54.61,40.77
  Bottom 0.813: D9.C D10.A

### Text on the board
tPlace: 9 | 16 | 15 | 14 | 13 | 12 | 11 | 10 | NEUTRAL | ena | LIVE | vcc | gnd | tx | Serial | v2 | rx | BT-module | SmallRoomLabs.com/DimBlue | stat | 1 | 2 | 3 | 4 | 5 | 6 | 7 | 8